# EAGLE design hack (EAGLE 7.3.0)
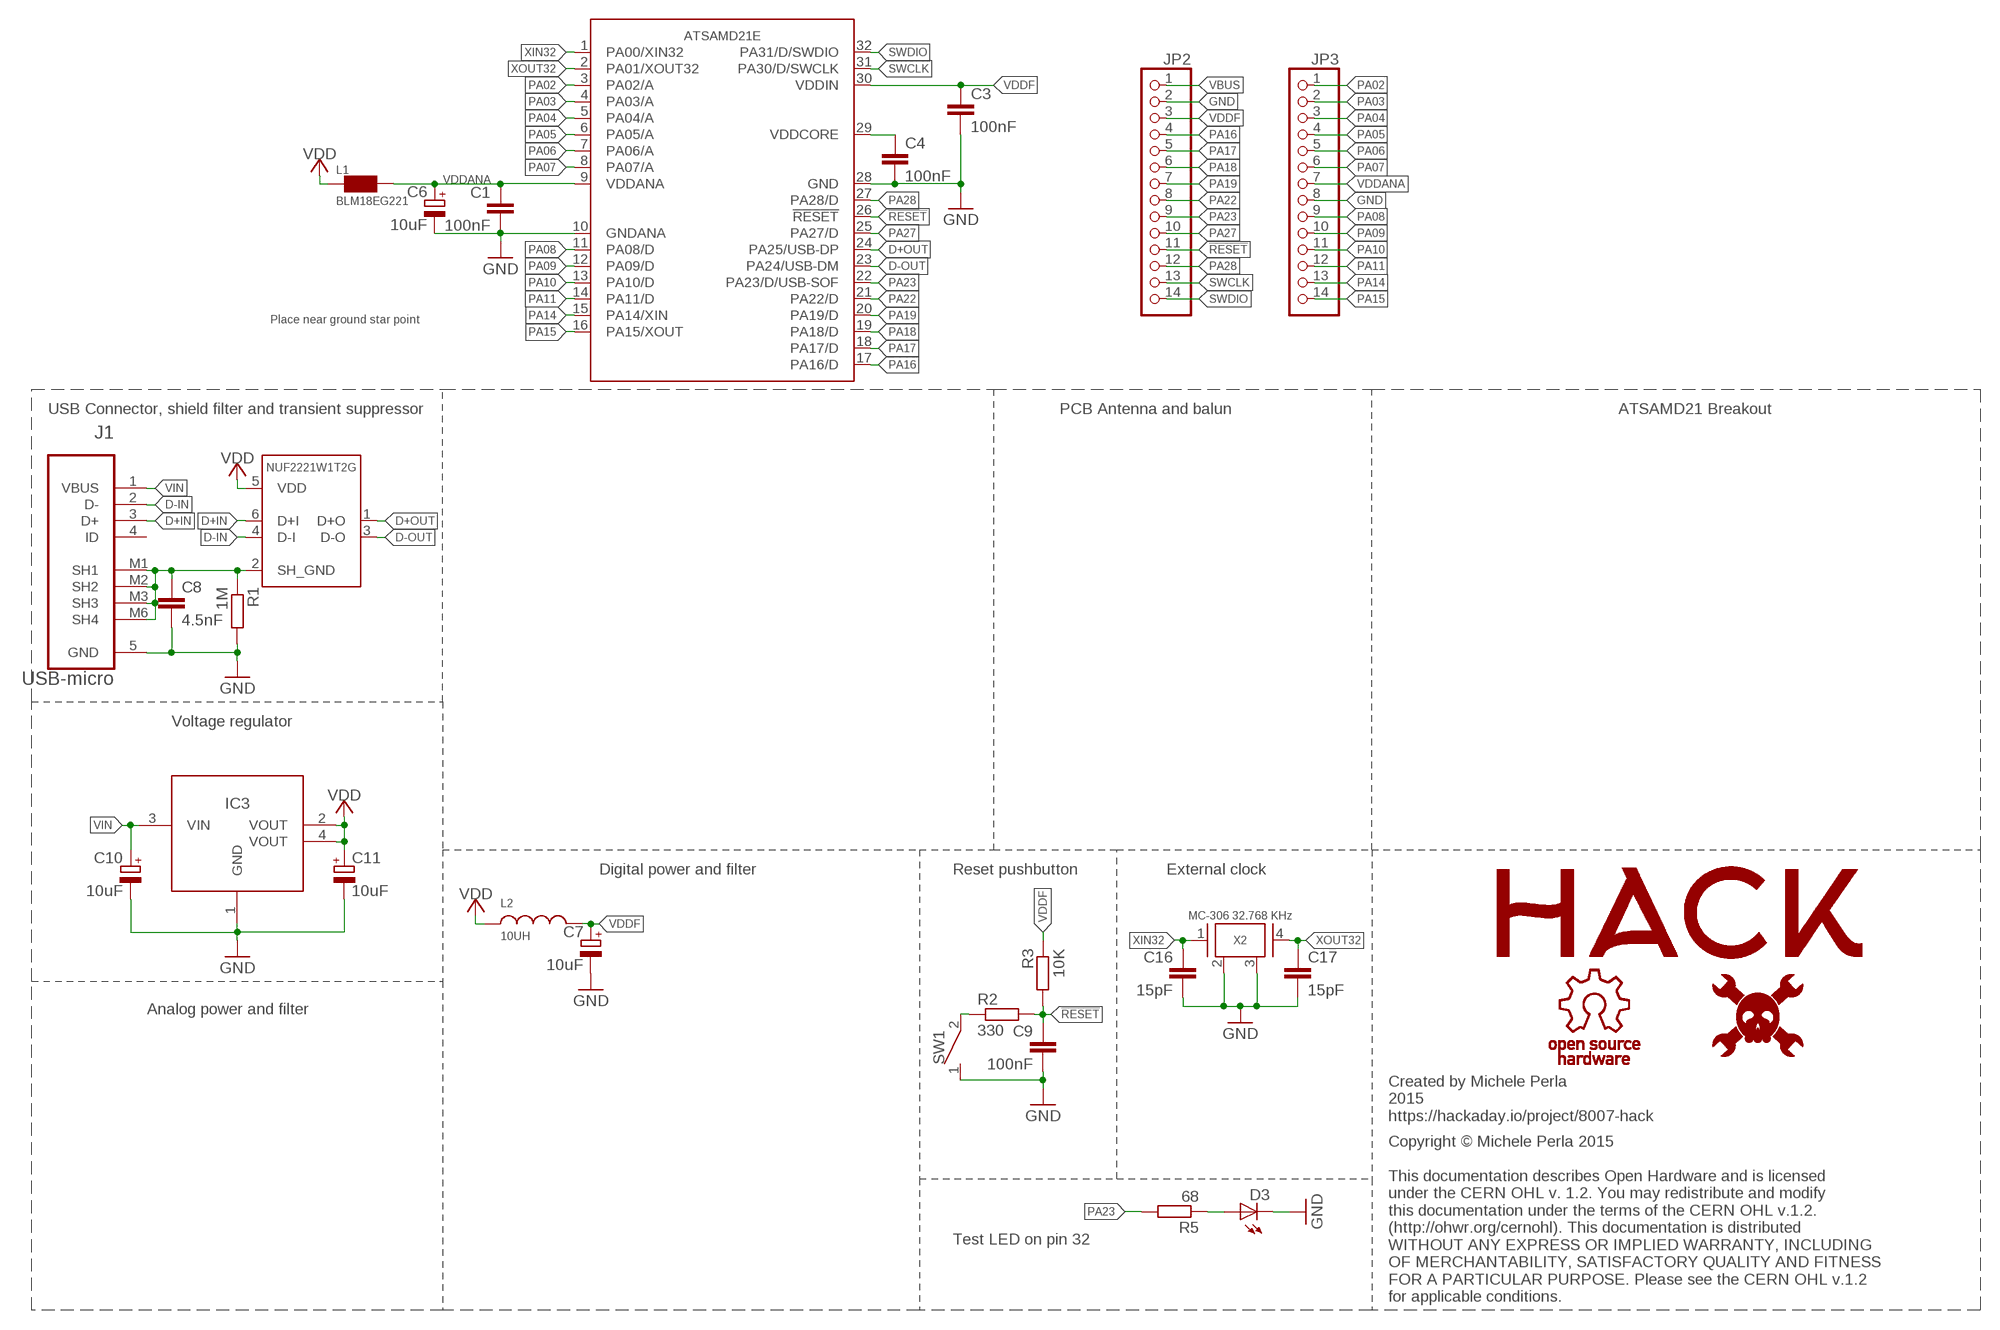
[diagram p0: schematic, sheet 1]

## Parts
C1  100nF  C-EU  [C0402]
C3  100nF  C-EU  [C0402]
C4  100nF  C-EU  [C0402]
C6  10uF  CPOL-EUCT3216  [CT3216]
C7  10uF  CPOL-EUCT3216  [CT3216]
C8  4.5nF  C-EU  [C0402]
C9  100nF  C-EU  [C0402]
C10  10uF  CPOL-EUCT3216  [CT3216]
C11  10uF  CPOL-EUCT3216  [CT3216]
C16  15pF  C-EU  [C0402]
C17  15pF  C-EU  [C0402]
D3  LED  [LED-0603]
IC1  NUF2221W1T2G  [SOT-363]
IC3  LDO  [SOT-223-3]
J1  USB-micro  47346-0001  [MOLEX_47346-0001]
JP2  PINHD-1X14  [1X14]
JP3  PINHD-1X14  [1X14]
L1  BLM18EG221  L  [0603]
L2  10UH  ELLVFG100MC-VXG  [IND_ELLVXG]
LOGO1  HACK-LOGO  [HACK-LOGO]
R1  1M  R-EU  [R0603]
R2  330  R-EU  [R0603]
R3  10K  R-EU  [R0603]
R5  68  R-EU  [R0603]
SW1  SPST3.5X6MM  [SWITCH-SMD-3.5X6MM]
U1  ATSAMD21E  [TQFP32]
U$5  HAD-LOGO  [HAD-LOGO]
U$6  OSHW-LOGO  [OSHW-LOGO]
X2  MC-306 32.768 KHz  XTALMC-306  [MC-306]

## Nets
!RESET: C9.1 JP2.11 R2.2 R3.2 U1.26(!RESET)
D+IN: IC1.6(D+I) J1.3(D+)
D+OUT: IC1.1(D+O) U1.24(PA25/USB-DP)
D-IN: IC1.4(D-I) J1.2(D-)
D-OUT: IC1.3(D-O) U1.23(PA24/USB-DM)
GND: C1.2 C3.2 C4.2 C6.- C7.- C8.2 C9.2 C10.- C11.- C16.2 C17.2 D3.C IC3.1(GND) J1.5(GND) JP2.2 JP3.8 R1.2 SW1.1 U1.10(GNDANA) U1.28(GND) X2.2(GND) X2.3(GND)
N$1: D3.A R5.1
N$2: C4.1 U1.29(VDDCORE)
N$3: R2.1 SW1.2
PA02: JP3.1 U1.3(PA02/A)
PA03: JP3.2 U1.4(PA03/A)
PA04: JP3.3 U1.5(PA04/A)
PA05: JP3.4 U1.6(PA05/A)
PA06: JP3.5 U1.7(PA06/A)
PA07: JP3.6 U1.8(PA07/A)
PA08: JP3.9 U1.11(PA08/D)
PA09: JP3.10 U1.12(PA09/D)
PA10: JP3.11 U1.13(PA10/D)
PA11: JP3.12 U1.14(PA11/D)
PA14: JP3.13 U1.15(PA14/XIN)
PA15: JP3.14 U1.16(PA15/XOUT)
PA16: JP2.4 U1.17(PA16/D)
PA17: JP2.5 U1.18(PA17/D)
PA18: JP2.6 U1.19(PA18/D)
PA19: JP2.7 U1.20(PA19/D)
PA22: JP2.8 U1.21(PA22/D)
PA23: JP2.9 R5.2 U1.22(PA23/D/USB-SOF)
PA27: JP2.10 U1.25(PA27/D)
PA28: JP2.12 U1.27(PA28/D)
SH_GND: C8.1 IC1.2(SH_GND) J1.M1(SH1) J1.M2(SH2) J1.M3(SH3) J1.M6(SH4) R1.1
SWCLK: JP2.13 U1.31(PA30/D/SWCLK)
SWDIO: JP2.14 U1.32(PA31/D/SWDIO)
VBUS: JP2.1
VDD: C11.+ IC1.5(VDD) IC3.2(VOUT) IC3.4(VOUT) L1.1 L2.2
VDDANA: C1.1 C6.+ JP3.7 L1.2 U1.9(VDDANA)
VDDF: C3.1 C7.+ JP2.3 L2.1 R3.1 U1.30(VDDIN)
VIN: C10.+ IC3.3(VIN) J1.1(VBUS)
XIN32: C16.1 U1.1(PA00/XIN32) X2.1
XOUT32: C17.1 U1.2(PA01/XOUT32) X2.4
Unconnected: J1.4(ID)

## Notes on the sheet
- Place near ground star point
- USB Connector, shield filter and transient suppressor | PCB Antenna and balun | ATSAMD21 Breakout
- Voltage regulator
- Digital power and filter | Reset pushbutton | External clock
- Analog power and filter
- Created by Michele Perla
  2015
  https://hackaday.io/project/8007-hack
- Test LED on pin 32
- Copyright © Michele Perla 2015
  
  This documentation describes Open Hardware and is licensed 
  under the CERN OHL v. 1.2. You may redistribute and modify 
  this documentation under the terms of the CERN OHL v.1.2. 
  (http://ohwr.org/cernohl). This documentation is distributed
  WITHOUT ANY EXPRESS OR IMPLIED WARRANTY, INCLUDING 
  OF MERCHANTABILITY, SATISFACTORY QUALITY AND FITNESS
  FOR A PARTICULAR PURPOSE. Please see the CERN OHL v.1.2
  for applicable conditions.

## Library data of the parts
C1 C3 C4 C8 C9 C16 C17 = jack:C-EU
C6 C7 C10 C11 = jack:CPOL-EU
D3 = jack:LED: Blue LED Mouser Part 720-LBQ39EN1P1351
IC1 = jack:NUF2221W1T2G: ON SEMICONDUCTOR NUF2221W1T2G IC, FILTER, USB, ESD PROTECTION, SOT363; EAGLEUP: SOT363
IC3 = hack:LDO; EAGLEUP: SOT223
J1 = Molex-47346-0001:47346-0001: CONN RCPT 5POS MICRO USB R/A SMD; MPN: 47346-0001; OC_FARNELL: 1568026; OC_NEWARK: 47M0505; PACKAGE: 5 POS MICRO USB R/A; SUPPLIER: MOLEX
JP2 JP3 = pinhead:PINHD-1X14: PIN HEADER
L1 = jack:L: Ferrite bead; EAGLEUP: R0603
L2 = Panasonic-ELL:ELL: Choke Coils; EAGLEUP: ELLVFG; MPN: ELLVFG100MC; OC_FARNELL: 1717407; OC_NEWARK: 15R1033; PACKAGE: 3X3X1.2MM; SUPPLIER: PANASONIC
LOGO1 = hack:HACK-LOGO
R1-R3 R5 = jack:R-EU
SW1 = jack:SPST: Tactile Switches 3.5X6 SMT TACT TACT SWITCH - Mouser part # 506-FSMSM; EAGLEUP: MOM-1181
U1 = hack:ATSAMD21E
U$5 = jack:HAD-LOGO
U$6 = jack:OSHW-LOGO
X2 = hack:XTAL

## Board
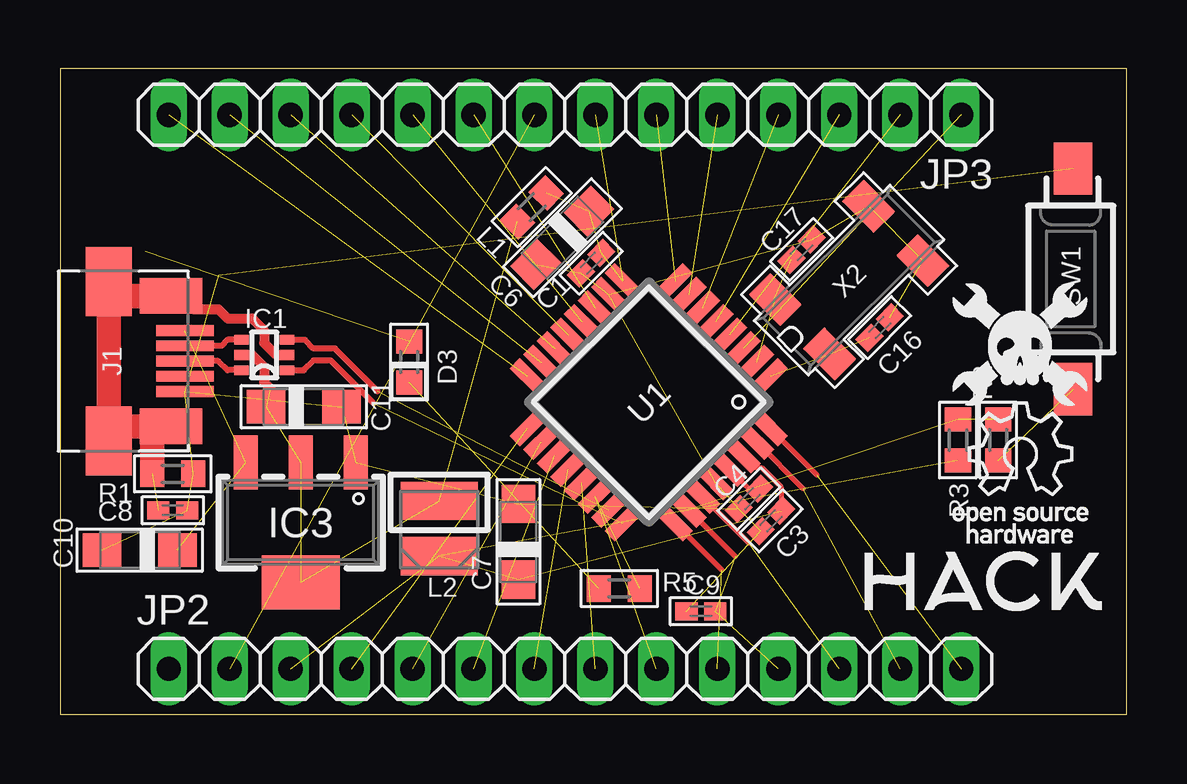
[diagram p1: board, top side]
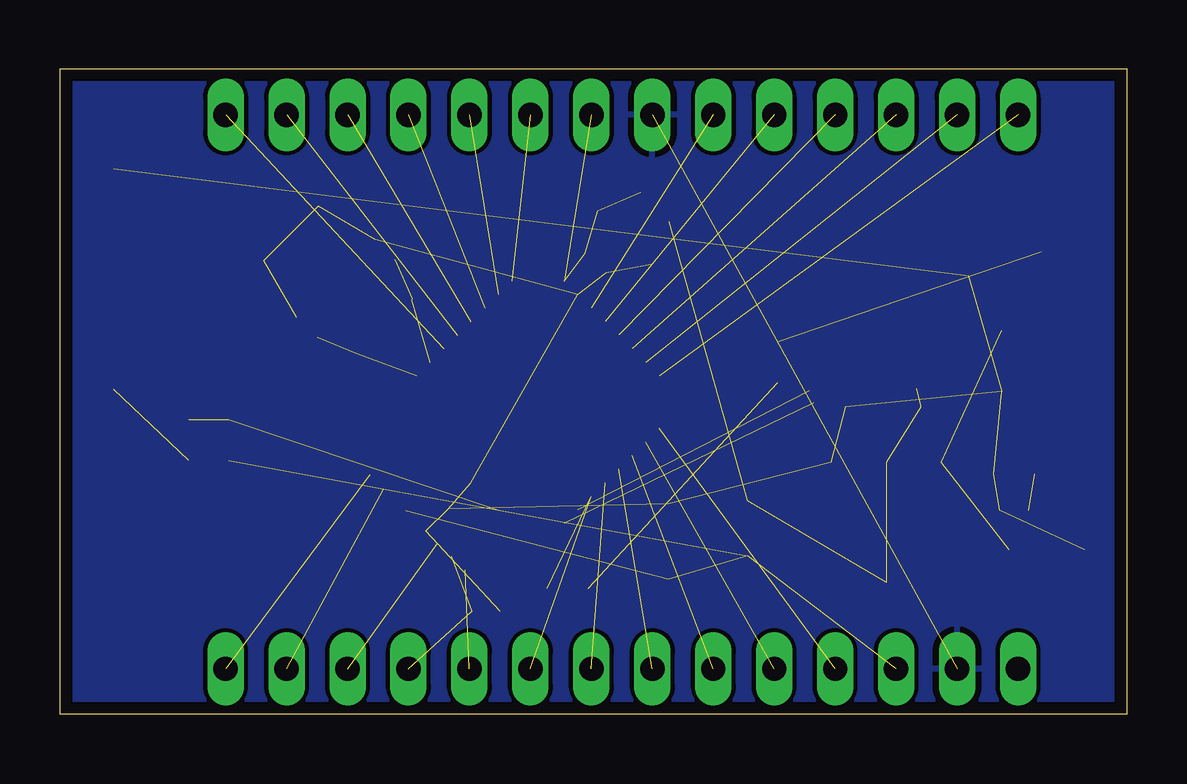
[diagram p2: board, bottom side, seen from below]

Size 44.45 x 26.93 mm. Coordinates in mm from the lower left corner, seen from the top.
Outline: 0,0 44.45,0 44.45,26.93 0,26.93 0,0
Copper layers (1*16): Top 0.035mm / dielectric 1.5mm / Bottom 0.035mm
Design rules "smart proto rules": minimum track width 7mil, minimum drill 12mil, track to track 7mil, track to pad 7mil, pad to pad 7mil, via to via 7mil, smd to smd 0mil, copper to edge 20mil, drill to drill 10mil, minimum pad ring 10mil, minimum via ring 6mil, stop-mask expansion 2mil, vias tented up to drill 25mil, thermal gap 10mil

### Footprints (pad centres in the part's own frame; a part is rotated, then mirrored left to right if it is on the bottom)
C0402 = smd 0.925 x 0.74: 1 -0.6,0; 2 0.6,0
CT3216 = smd 1.6 x 1.4: + -1.575,0; - 1.575,0
LED-0603 = smd 1 x 1.1: A -0.85,0; C 0.85,0
SOT-363 = smd 0.6 x 0.4: 1 -0.953,0.635; 2 -0.953,0; 3 -0.953,-0.635; 4 0.953,-0.635; 5 0.953,0; 6 0.953,0.635
SOT-223-3 = smd 1 x 2.25: 1 -2.3,-2.5; 2 0,-2.5; 3 2.3,-2.5 | smd 3.25 x 2.25: 4 0,2.5
MOLEX_47346-0001 = smd 0.45 x 2.388: 1 -1.27,0.508; 2 -0.635,0.508; 3 0,0.508; 4 0.635,0.508; 5 1.27,0.508 | smd 1.475 x 2.6: M1 -2.718,-0.081; M2 2.718,-0.081 | smd 2.875 x 1.9: M3 -3.321,-2.667; M6 3.321,-2.667
1X14 = drill 1.016 long: 1 -16.51,0; 2 -13.97,0; 3 -11.43,0; 4 -8.89,0; 5 -6.35,0; 6 -3.81,0; 7 -1.27,0; 8 1.27,0; 9 3.81,0; 10 6.35,0; 11 8.89,0; 12 11.43,0; 13 13.97,0; 14 16.51,0
0603 = smd 1 x 1.1: 1 -0.85,0; 2 0.85,0
IND_ELLVXG = smd 1.6 x 3.2: 1 -1.1,0; 2 1.2,0
R0603 = smd 1 x 1.1: 1 -0.85,0; 2 0.85,0
SWITCH-SMD-3.5X6MM = smd 2.18 x 1.6: 1 -4.6,0.1; 2 4.6,0.1
TQFP32 = smd 1.5 x 0.6: 1 -4.35,2.8; 2 -4.35,2; 3 -4.35,1.2; 4 -4.35,0.4; 5 -4.35,-0.4; 6 -4.35,-1.2; 7 -4.35,-2; 8 -4.35,-2.8; 17 4.35,-2.8; 18 4.35,-2; 19 4.35,-1.2; 20 4.35,-0.4; 21 4.35,0.4; 22 4.35,1.2; 23 4.35,2; 24 4.35,2.8 | smd 0.6 x 1.5: 9 -2.8,-4.35; 10 -2,-4.35; 11 -1.2,-4.35; 12 -0.4,-4.35; 13 0.4,-4.35; 14 1.2,-4.35; 15 2,-4.35; 16 2.8,-4.35; 25 2.8,4.35; 26 2,4.35; 27 1.2,4.35; 28 0.4,4.35; 29 -0.4,4.35; 30 -1.2,4.35; 31 -2,4.35; 32 -2.8,4.35
MC-306 = smd 1.3 x 1.9: 1 -2.75,-1.6; 2 2.75,-1.6; 3 2.75,1.6; 4 -2.75,1.6

### Placement (x,y rotation side)
C1  22.13,18.82 225 top
C3  29.63,8.07 225 top
C4  28.71,8.99 225 top
C6  20.93,19.88 225 top
C7  19.1,7.2 90 top
C8  4.7,8.51 0 top
C9  26.7,4.3 180 top
C10  3.32,6.85 180 top
C11  10.16,12.83 0 top
C16  34.15,16.13 45 top
C17  30.9,19.38 45 top
D3  14.55,14.69 90 top
IC1  8.51,14.99 180 top
IC3  10.03,8 180 top
J1  4.7,14.73 270 top
JP2  21.04,1.9 0 top
JP3  21.04,25 180 top
L1  19.66,21.15 45 top
L2  15.8,7.7 90 top
LOGO1  38.42,5.25 0 top
R1  4.7,10.03 0 top
R2  39.09,11.44 90 top
R3  37.41,11.44 90 top
R5  23.3,5.25 0 top
SW1  42.11,18.16 270 top
U1  24.53,13.02 225 top
U$5  39.99,15.01 0 top
U$6  39.99,10.26 0 top
X2  32.88,18.11 45 top

### Tracks (layer width: path | path; a pad name or v marks a point on that pad's centre or on a via)
!RESET  (4 unrouted)
  Top 0.2: U1.26 28.14,6.58
D+IN
  Top 0.203: 5.33,14.61 J1.3
  Top 0.254: IC1.6 6.99,14.35 6.6,14.73 J1.3
D+OUT  (1 unrouted)
  Top 0.254: IC1.1 10.16,14.35 10.57,14.76 11.28,14.76 13.05,12.98
D-IN
  Top 0.254: IC1.4 6.99,15.62 6.73,15.37 J1.2
D-OUT  (1 unrouted)
  Top 0.254: IC1.3 10.2,15.62 10.56,15.26 11.45,15.26 13.23,13.48
GND  (23 unrouted)
  pour Bottom (isolate 0.178): 0,26.92 44.45,26.92 44.45,0 0,0
N$1  (1 unrouted)
N$2
  Top 0.2: U1.29 28.71,9.41 C4.1
N$3  (1 unrouted)
PA02  (1 unrouted)
PA03  (1 unrouted)
PA04  (1 unrouted)
PA05  (1 unrouted)
PA06  (1 unrouted)
PA07  (1 unrouted)
PA08  (1 unrouted)
PA09  (1 unrouted)
PA10  (1 unrouted)
PA11  (1 unrouted)
PA14  (1 unrouted)
PA15  (1 unrouted)
PA16  (1 unrouted)
PA17  (1 unrouted)
PA18  (1 unrouted)
PA19  (1 unrouted)
PA22  (1 unrouted)
PA23  (2 unrouted)
PA27  (1 unrouted)
  Top 0.2: U1.25 27.57,6.02
PA28  (1 unrouted)
  Top 0.2: U1.27 28.71,7.15
SH_GND  (1 unrouted)
  Top 0.406: IC1.2 9.02,14.99 8.51,15.49 8.51,16 8,16.51 6.99,16.51 6.6,16.89 5.59,16.89 5.03,17.45 J1.M1
  Top 0.61: 2.08,12.01 2.03,12.06 J1.M6 2.09,11.41 | J1.M3 2.16,17.93 2.16,17.53 2.23,17.45 2.03,17.25
  Top 1.016: R1.1 3.85,11.72 | 3.85,11.72 4.06,11.94 4.54,11.94 J1.M2 | 2.08,12.01 3.56,12.01 3.85,11.72 | 2.03,12.06 J1.M3 | 2.23,17.45 J1.M1
SWCLK  (1 unrouted)
  Top 0.2: U1.31 30.97,9.41
SWDIO  (1 unrouted)
  Top 0.2: U1.32 31.54,9.98
VDD  (5 unrouted)
  Top 0.406: IC1.5 8,14.99 8.51,14.48 8.51,13.84 8.76,13.59
VDDANA  (4 unrouted)
VDDF  (4 unrouted)
  Top 0.2: U1.30 28.95,10.29 29.24,10.29 30.05,9.48 C3.1
VIN  (2 unrouted)
XIN32  (2 unrouted)
XOUT32  (2 unrouted)
  Top 0.305: X2.4 29.76,17.32

### Text on the board
tDocu: Copyright © Michele Perla 2015 / / This documentation describes Open Hardware and is licensed / under the CERN OHL v. 1.2. You may redistribute and modify / this documentation under the terms of the CERN OHL v.1.2. / (http://ohwr.org/cernohl). This documentation is distributed / WITHOUT ANY EXPRESS OR IMPLIED WARRANTY, INCLUDING / OF MERCHANTABILITY, SATISFACTORY QUALITY AND FITNESS / FOR A PARTICULAR PURPOSE. Please see the CERN OHL v.1.2 / for applicable conditions.